# EAGLE design DUAL TRANSFORMER - OUTPUTboard (EAGLE 9.6.2)

## Sheet 1 of 2
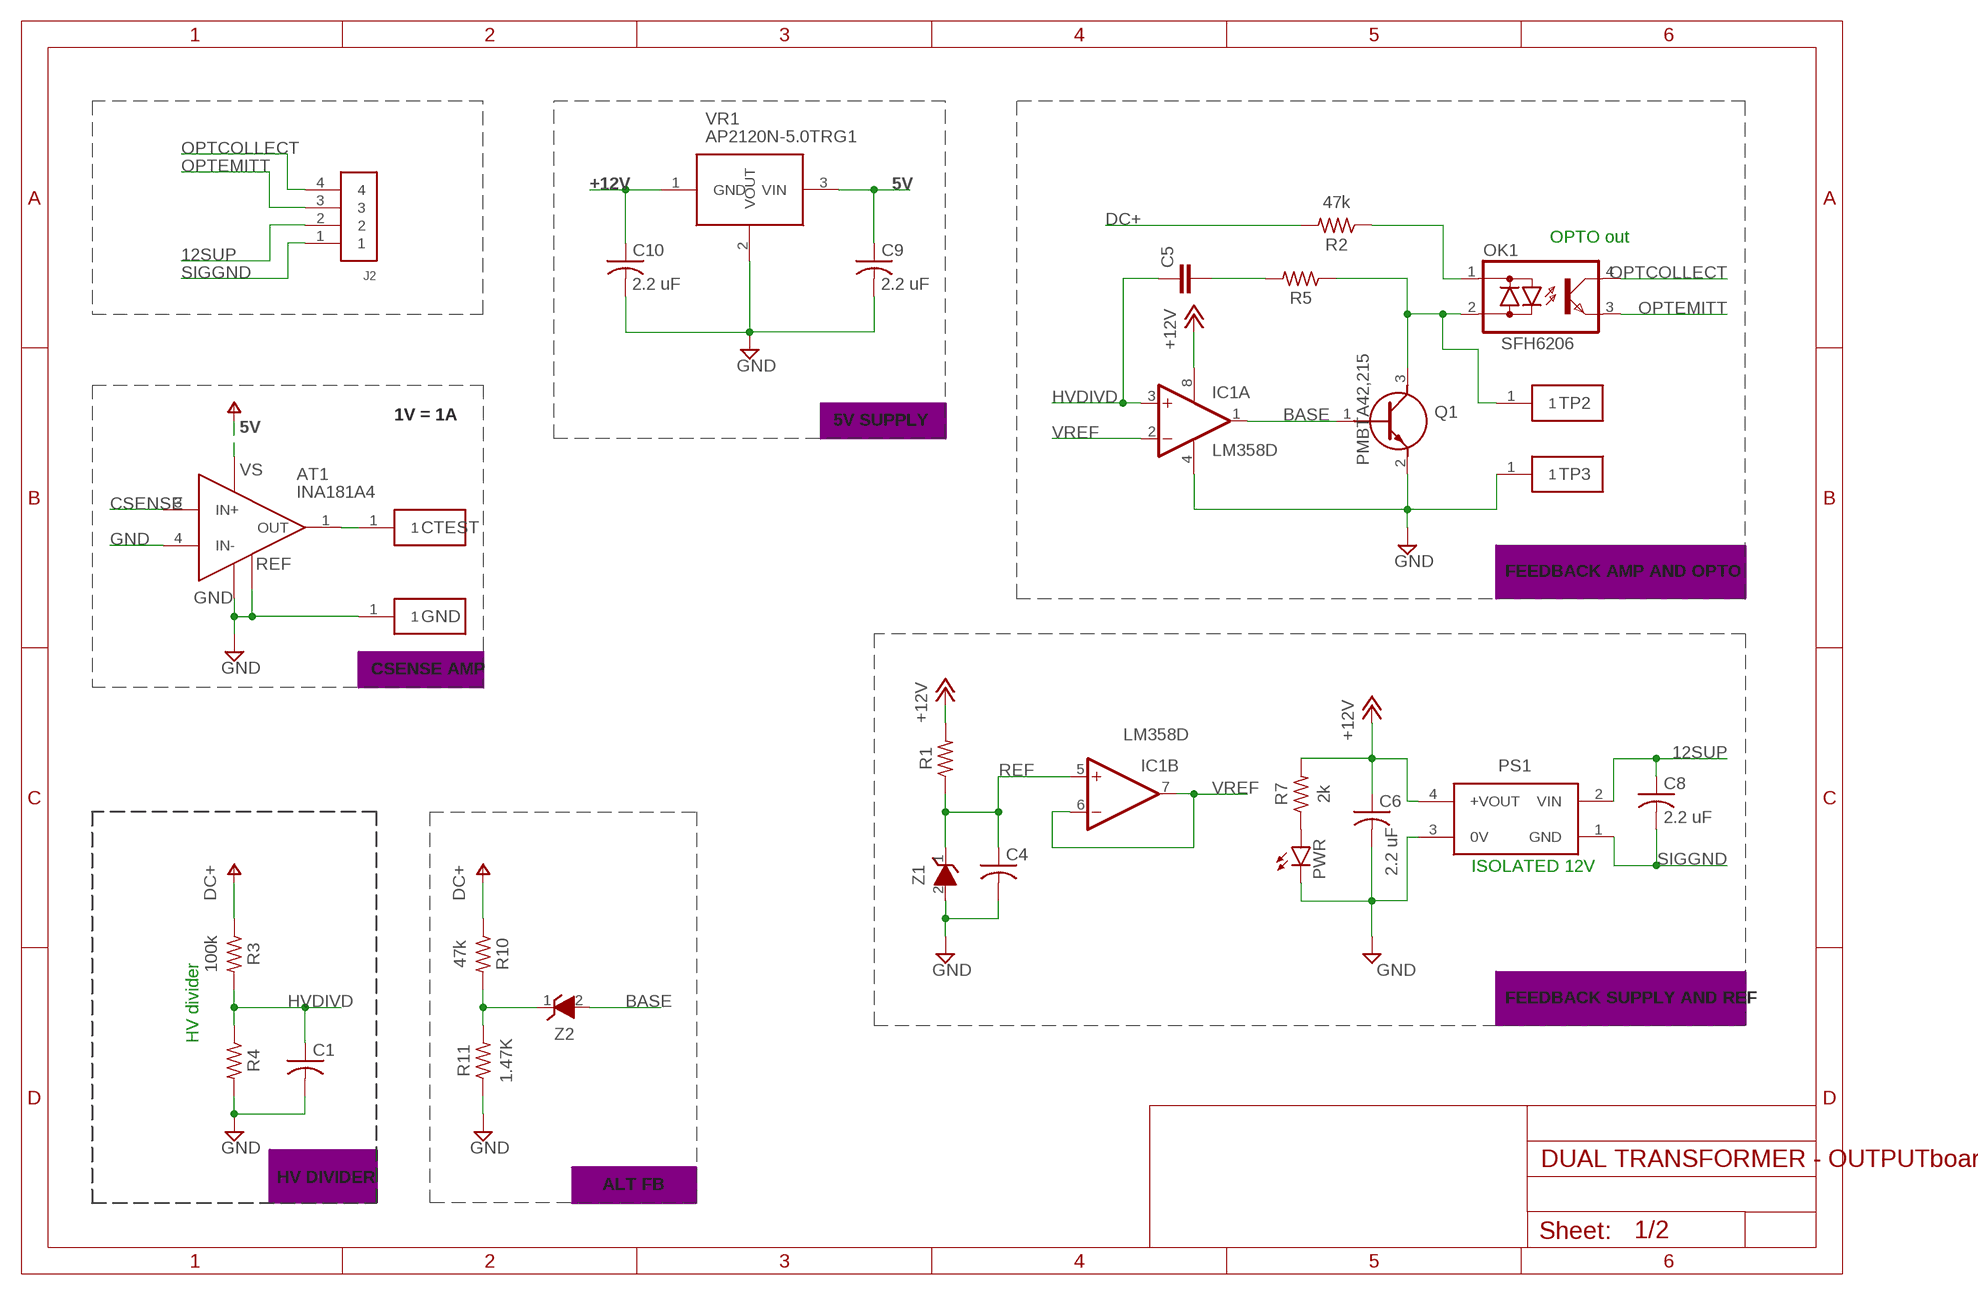
[diagram p0: schematic, sheet 1]

### Parts
AT1  INA181A4  INA181A3IDBVR  [SOT95P280X145-6N]
C1  C-USC0805  [C0805]
C4  C-USC0805  [C0805]
C5  C-EUC0805  [C0805]
C6  2.2 uF  C-USC0805  [C0805]
C8  2.2 uF  C-USC0805  [C0805]
C9  2.2 uF  C-USC0805  [C0805]
C10  2.2 uF  C-USC0805  [C0805]
CTEST  RCT-0C  [RCT-0C]
GND  RCT-0C  [RCT-0C]
IC1  LM358D  [SO08]
J2  61300411121  [61300411121]
OK1  SFH6206  [DIL4-SMD]
PS1  PDSE1-S12-S3-SPDSE1S12S12S  [PDSE1S12S3S]
PWR  LEDSML0805  [SML0805]
Q1  PMBTA42,215  [SOT95P230X110-3N]
R1  R-US_CHIP-0805(2012-METRIC)  [RESC2012X65]
R2  47k  R-US_MELF0207R  [MINI_MELF-0207R]
R3  100k  R-US_MELF0207R  [MINI_MELF-0207R]
R4  R-US_CHIP-0805(2012-METRIC)  [RESC2012X65]
R5  R-US_CHIP-0805(2012-METRIC)  [RESC2012X65]
R7  2k  R-US_CHIP-0805(2012-METRIC)  [RESC2012X65]
R10  47k  R-US_MELF0207R  [MINI_MELF-0207R]
R11  1.47K  R-US_CHIP-0805(2012-METRIC)  [RESC2012X65]
TP2  RCT-0C  [RCT-0C]
TP3  RCT-0C  [RCT-0C]
VR1  AP2120N-5.0TRG1  [SOT95P240X120-3N]
Z1  BZT52-C5V1_R1_00001  [SOD3816X135N]
Z2  BZT52-C5V1_R1_00001  [SOD3816X135N]

### Nets
5V: AT1.6(VS) C9.1 VR1.3(VIN) ; supply symbol labelled V+
12SUP: C8.1 J2.2 PS1.2(VIN)
+12V: C6.1 C10.1 IC1.8(P:V+) PS1.4(+VOUT) R1.2 R7.2 VR1.1(GND)
BASE: IC1.1(A:OUT) Q1.1(B) Z2.2(A)
CSENSE: AT1.3(IN+) ; also sheet 2
DC+: R2.2 R3.1 R10.1 ; supply symbol labelled V+ ; also sheet 2
GND: AT1.2(GND) AT1.4(IN-) AT1.5(REF) C1.2 C4.2 C6.2 C9.2 C10.2 GND.1 IC1.4(P:V-) PS1.3(0V) PWR.C Q1.2(E) R4.2 R11.1 TP3.1 VR1.2(VOUT) Z1.2(A) ; also sheet 2
HVDIVD: C1.1 C5.1 IC1.3(A:+IN) R3.2 R4.1
N$1: PWR.A R7.1
N$2: R10.2 R11.2 Z2.1(K)
N$4: OK1.1(AC1) R2.1
N$7: C5.2 R5.2
N$10: AT1.1(OUT) CTEST.1
OPTCOLLECT: J2.4 OK1.4(C)
OPTEMITT: J2.3 OK1.3(E)
OPTOANODE: OK1.2(AC2) Q1.3(C) R5.1 TP2.1
REF: C4.1 IC1.5(B:+IN) R1.1 Z1.1(K)
SIGGND: C8.2 J2.1 PS1.1(GND)
VREF: IC1.2(A:-IN) IC1.6(B:-IN) IC1.7(B:OUT)

### Notes on the sheet
- OPTO out
- 1V = 1A
- 5V SUPPLY
- FEEDBACK AMP AND OPTO
- CSENSE AMP
- ISOLATED 12V
- FEEDBACK SUPPLY AND REF
- HV divider
- HV DIVIDER
- ALT FB

## Sheet 2 of 2
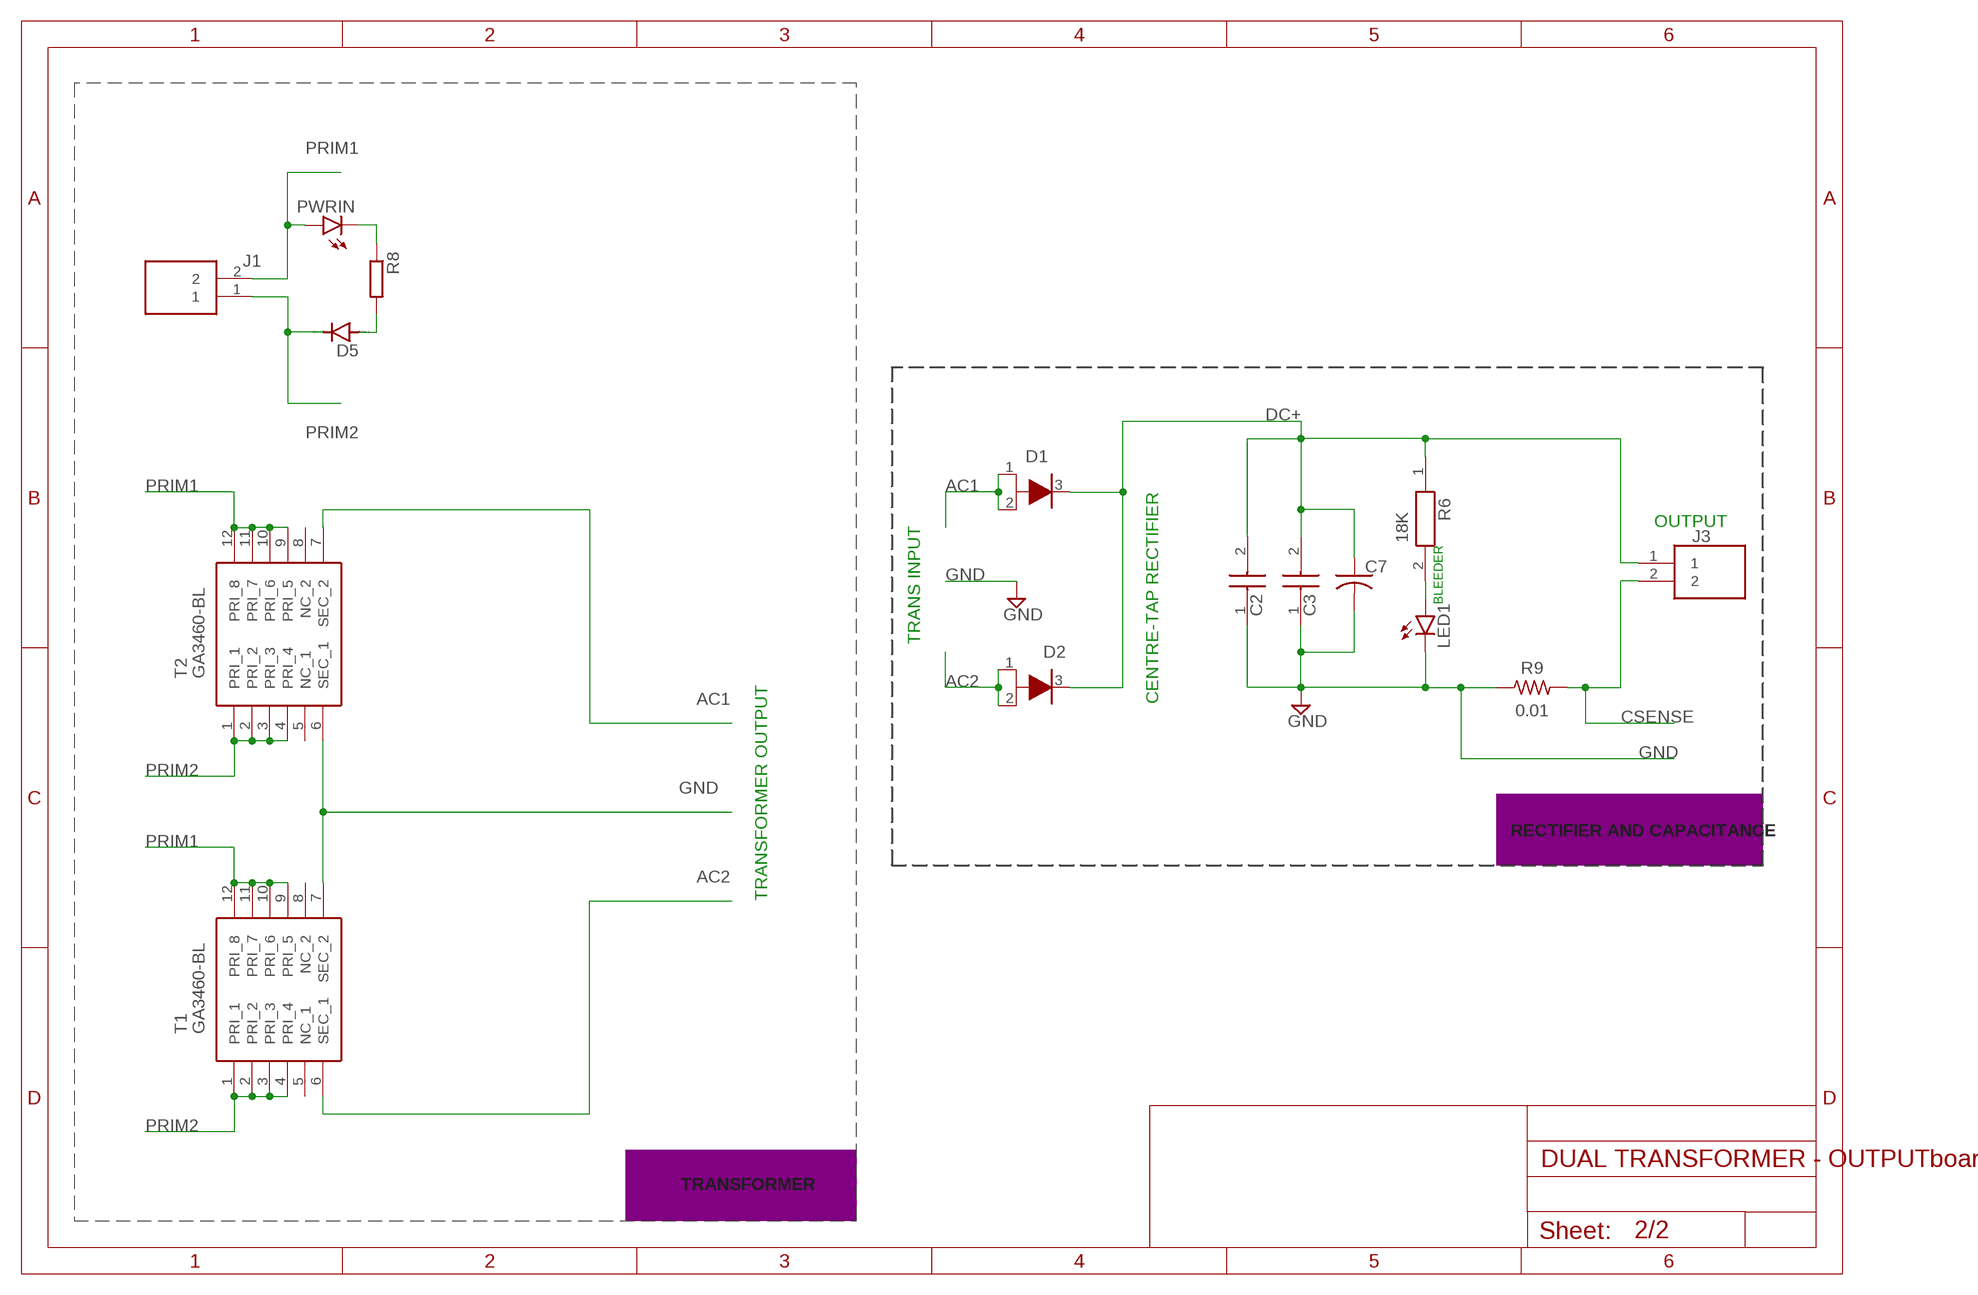
[diagram p1: schematic, sheet 2]

### Parts
C2  ELH227M400AS2AV  [CAPPRD1000W140D3000H3200]
C3  ELH227M400AS2AV  [CAPPRD1000W140D3000H3200]
C7  C-USC1210K  [C1210K]
D1  VS-16EDH02HM3_I  [V40DL45BPM3I]
D2  VS-16EDH02HM3_I  [V40DL45BPM3I]
D5  DIODE-DO-214AC  [DO-214AC]
J1  2305908-2  [23059082]
J3  2305908-2  [23059082]
LED1  LED5MM  [LED5MM]
PWRIN  LEDSML0805  [SML0805]
R6  18K  MOS2CT52R183J  [RESAD3100W80L1500D400]
R8  R-EU_R0805  [R0805]
R9  0.01  R-US_CHIP-2512(6332-METRIC)  [RESC6332X71]
T1  GA3460-BL  [GA3460BL]
T2  GA3460-BL  [GA3460BL]

### Nets
AC1: D1.1(A_1) D1.2(A) T2.7(SEC_2)
AC2: D2.1(A_1) D2.2(A) T1.6(SEC_1)
CSENSE: J3.2 R9.2 ; also sheet 1
DC+: C2.2(-) C3.2(-) C7.1 D1.3(K) D2.3(K) J3.1 R6.1 ; also sheet 1
GND: C2.1(+) C3.1(+) C7.2 LED1.K(C) R9.1 T1.7(SEC_2) T2.6(SEC_1) ; also sheet 1
N$3: D5.A R8.2
N$5: LED1.A R6.2
N$6: PWRIN.C R8.1
PRIM1: J1.2 PWRIN.A T1.9(PRI_5) T1.10(PRI_6) T1.11(PRI_7) T1.12(PRI_8) T2.9(PRI_5) T2.10(PRI_6) T2.11(PRI_7) T2.12(PRI_8)
PRIM2: D5.C J1.1 T1.1(PRI_1) T1.2(PRI_2) T1.3(PRI_3) T1.4(PRI_4) T2.1(PRI_1) T2.2(PRI_2) T2.3(PRI_3) T2.4(PRI_4)
Unconnected: T1.5(NC_1) T1.8(NC_2) T2.5(NC_1) T2.8(NC_2)

### Notes on the sheet
- CENTRE-TAP RECTIFIER
- TRANS INPUT | OUTPUT
- BLEEDER
- RECTIFIER AND CAPACITANCE
- TRANSFORMER OUTPUT
- TRANSFORMER

## Library data of the parts
AT1 = SamacSys_Parts:INA181A3IDBVR: Automotive, 26V bi-directional current sense amplifier for cost-sensitive systems Source: Datasheet <http://www.ti.com/lit/gpn/INA181>; DESCRIPTION: Automotive, 26V bi-directional current sense amplifier for cost-sensitive systems; HEIGHT: 1.45mm; MANUFACTURER_NAME: Texas Instruments; MANUFACTURER_PART_NUMBER: INA181A3IDBVR; MOUSER_PART_NUMBER: 595-INA181A3IDBVR; MOUSER_PRICE-STOCK: https://www.mouser.co.uk/ProductDetail/Texas-Instruments/INA181A3IDBVR?qs=5aG0NVq1C4xG8aOdRB7o5A%3D%3D
C1 C4 C6-C10 = rcl:C-US: CAPACITOR, American symbol; SPICEPREFIX: C
C2 C3 = SamacSys_Parts:ELH227M400AS2AV: Aluminum Electrolytic Capacitors - Snap In 400V 220uF 20% 85C Radial Source: Datasheet <https://www.kemet.com/specsheet/ELH227M400AS2AV>; DESCRIPTION: Aluminum Electrolytic Capacitors - Snap In 400V 220uF 20% 85C Radial; HEIGHT: 32mm; MANUFACTURER_NAME: Kemet; MANUFACTURER_PART_NUMBER: ELH227M400AS2AV; MOUSER_PART_NUMBER: 80-ELH227M400AS2AV; MOUSER_PRICE-STOCK: https://www.mouser.co.uk/ProductDetail/KEMET/ELH227M400AS2AV?qs=gt1LBUVyoHkpN%252BwKS%2FOtFw%3D%3D
C5 = rcl:C-EU: CAPACITOR, European symbol; SPICEPREFIX: C
CTEST GND TP2 TP3 = SamacSys_Parts:RCT-0C: TE CONNECTIVITY / CGS - RCT-0C - TEST POINT, 0805 CASE SIZE Source: Datasheet; DESCRIPTION: TE CONNECTIVITY / CGS - RCT-0C - TEST POINT, 0805 CASE SIZE; HEIGHT: mm; MANUFACTURER_NAME: TE Connectivity; MANUFACTURER_PART_NUMBER: RCT-0C; MOUSER_PART_NUMBER: 279-RCT-0C; MOUSER_PRICE-STOCK: https://www.mouser.co.uk/ProductDetail/TE-Connectivity-Holsworthy/RCT-0C?qs=ip69W3eHERWzZOsRKmFYAw%3D%3D
D1 D2 = SamacSys_Parts:VS-16EDH02HM3_I: VISHAY -VS-8ETH03S-M3 - RECTIFIER, 8A, 300V, TO-263AC Source: Datasheet <https://www.mouser.com/datasheet/2/427/VISH_S_A0007982235_1-2570276.pdf>; DESCRIPTION: VS-8ETH03S-M3 - RECTIFIER, 8A, 300V, TO-263; HEIGHT: 1mm; MANUFACTURER_NAME: Vishay; MANUFACTURER_PART_NUMBER: VS-8ETH03S-M3
D5 = diode:DIODE-: DIODE
IC1 = linear:LM358: OP AMP also LM158; LM258; LM2904 Source: http://cache.national.com/ds/LM/LM158.pdf
J1 J3 = SamacSys_Parts:2305908-2: TE CONNECTIVITY / BUCHANAN - 2305908-2 - TERMINAL BLOCK, HEADER, 2POS, SMD Source: Datasheet <https://www.te.com/commerce/DocumentDelivery/DDEController?Action=srchrtrv&DocNm=1-1773930-3_BuchananWM_Brochure&DocType=Data Sheet&DocLang=English&PartCntxt=2305908-2&DocFormat=pdf>; DESCRIPTION: TE CONNECTIVITY / BUCHANAN - 2305908-2 - TERMINAL BLOCK, HEADER, 2POS, SMD; HEIGHT: 9mm; MANUFACTURER_NAME: TE Connectivity; MANUFACTURER_PART_NUMBER: 2305908-2; MOUSER_PART_NUMBER: 571-2305908-2; MOUSER_PRICE-STOCK: https://www.mouser.co.uk/ProductDetail/TE-Connectivity-Buchanan/2305908-2?qs=BZBei1rCqCB0kX75zk6ERQ%3D%3D
J2 = Headers:61300411121: CONN HEADER VERT 4POS 2.54MM Manufacturer's datasheet <https://katalog.we-online.de/em/datasheet/6130xx11121.pdf>; CREATED_BY: PCBLayout.com; DIGI_KEY_PART_NUMBER: 732-5317-ND; MANUFACTURER: Wurth Electronics Inc.; MPN: 61300411121
LED1 PWR PWRIN = led:LED: LED OSRAM: - CHIPLED LG R971, LG N971, LY N971, LG Q971, LY Q971, LO R971, LY R971 LH N974, LH R974 LS Q976, LO Q976, LY Q976 LO Q996 - Hyper CHIPLED LW Q18S LB Q993, LB Q99A, LB R99A - SideLED LS A670, LO A670, LY A670, LG A670, LP A670 LB A673, LV A673, LT A673, LW A673 LH A674 LY A675 LS A676, LA A676, LO A676, LY A676, LW A676 LS A679, LY A679, LG A679 - Hyper Micro SIDELED® LS Y876, LA Y876, LO Y876, LY Y876 LT Y87S - SmartLED LW L88C, LW L88S LB L89C, LB L89S, LG L890 LS L89K, LO L89K, LY L89K LS L896, LA L896, LO L896, LY L896 - TOPLED LS T670, LO T670, LY T670, LG T670, LP T670 LSG T670, LSP T670, LSY T670, LOP T670, LYG T670 LG T671, LOG T671, LSG T671 LB T673, LV T673, LT T673, LW T673 LH T674 LS T676, LA T676, LO T676, LY T676, LB T676, LH T676, LSB T676, LW T676 LB T67C, LV T67C, LT T67C, LS T67K, LO T67K, LY T67K, LW E67C LS E67B, LA E67B, LO E67B, LY E67B, LB E67C, LV E67C, LT E67C LW T67C LS T679, LY T679, LG T679 LS T770, LO T770, LY T770, LG T770, LP T770 LB T773, LV T773, LT T773, LW T773 LH T774 LS E675, LA E675, LY E675, LS T675 LS T776, LA T776, LO T776, LY T776, LB T776 LHGB T686 LT T68C, LB T68C - Hyper Mini TOPLED® LB M676 - Mini TOPLED Santana® LG M470 LS M47K, LO M47K, LY M47K Source: http://www.osram.convergy.de LUXEON: - LUMILED® LXK2-PW12-R00, LXK2-PW12-S00, LXK2-PW14-U00, LXK2-PW14-V00 LXK2-PM12-R00, LXK2-PM12-S00, LXK2-PM14-U00 LXK2-PE12-Q00, LXK2-PE12-R00, LXK2-PE12-S00, LXK2-PE14-T00, LXK2-PE14-U00 LXK2-PB12-K00, LXK2-PB12-L00, LXK2-PB12-M00, LXK2-PB14-N00, LXK2-PB14-P00, LXK2-PB14-Q00 LXK2-PR12-L00, LXK2-PR12-M00, LXK2-PR14-Q00, LXK2-PR14-R00 LXK2-PD12-Q00, LXK2-PD12-R00, LXK2-PD12-S00 LXK2-PH12-R00, LXK2-PH12-S00 LXK2-PL12-P00, LXK2-PL12-Q00, LXK2-PL12-R00 Source: www.luxeon.com KINGBRIGHT: KA-3528ASYC Source: www.kingbright.com
OK1 = optocoupler:SFH620: Optocoupler, Phototransistor Output, AC Input Source: http://www.vishay.com/docs/83675/sfh620.pdf; MF: VISHAY/TELEFUNKEN; MPN: SFH6206-3; OC_FARNELL: 1469585; OC_NEWARK: 58K2214
PS1 = SamacSys_Parts:PDSE1-S12-S3-S: Isolated DC/DC Converters 12 Vdc, 0.303 A, 1 W, 10.8 13.2 Vdc Input Range Source: Datasheet <https://www.arrow.com/en/products/pdse1-s12-s3-s/cui-inc?region=nac>; DESCRIPTION: Isolated DC/DC Converters 12 Vdc, 0.303 A, 1 W, 10.8 13.2 Vdc Input Range; HEIGHT: 10.41mm; MANUFACTURER_NAME: CUI Inc.; MANUFACTURER_PART_NUMBER: PDSE1-S12-S12-S; MOUSER_PART_NUMBER: 490-PDSE1-S12-S12-S
Q1 = SamacSys_Parts:PMBTA42,215: PMBTA42 - 300 V, 100 mA NPN high-voltage transistor Source: Datasheet <http://assets.nexperia.com/documents/data-sheet/PMBTA42.pdf>; DESCRIPTION: PMBTA42 - 300 V, 100 mA NPN high-voltage transistor; HEIGHT: 1.1mm; MANUFACTURER_NAME: Nexperia; MANUFACTURER_PART_NUMBER: PMBTA42,215; MOUSER_PART_NUMBER: 771-PMBTA42-T/R; MOUSER_PRICE-STOCK: https://www.mouser.co.uk/ProductDetail/Nexperia/PMBTA42215?qs=LOCUfHb8d9skgG8A751Qfw%3D%3D
R1 R4 R5 R7 R9 R11 = Resistor:R-US: Resistor Fixed - ANSI; CATEGORY: Resistor; SUB-CATEGORY: Fixed
R2 R3 R10 = rcl:R-US_: RESISTOR, American symbol; SPICEPREFIX: R
R6 = SamacSys_Parts:MOS2CT52R183J: Metal Oxide Resistors 2W 18K 5% Source: Datasheet; DESCRIPTION: Metal Oxide Resistors 2W 18K 5%; HEIGHT: mm; MANUFACTURER_NAME: KOA Speer; MANUFACTURER_PART_NUMBER: MOS2CT52R183J
R8 = rcl:R-EU_: RESISTOR, European symbol; SPICEPREFIX: R
T1 T2 = SamacSys_Parts:GA3460-BL: Audio Transformers / Signal Transformers GA3460 for LT3751 500V 50A Source: Datasheet <https://componentsearchengine.com/Datasheets/1/GA3460-BL.pdf>; DESCRIPTION: Audio Transformers / Signal Transformers GA3460 for LT3751 500V 50A; HEIGHT: 14mm; MANUFACTURER_NAME: COILCRAFT; MANUFACTURER_PART_NUMBER: GA3460-BL; MOUSER_PART_NUMBER: 994-GA3460-BL; MOUSER_PRICE-STOCK: https://www.mouser.co.uk/ProductDetail/Coilcraft/GA3460-BL?qs=ZYnrCdKdyeeqpRItZMyzHA%3D%3D
VR1 = SamacSys_Parts:AP2120N-5.0TRG1: IC REG LINEAR 5V 150MA SOT23 Source: Datasheet; DESCRIPTION: IC REG LINEAR 5V 150MA SOT23; HEIGHT: 1.2mm; MANUFACTURER_NAME: Diodes Inc.; MANUFACTURER_PART_NUMBER: AP2120N-5.0TRG1; MOUSER_PART_NUMBER: 621-AP2120N-5.0TRG1; MOUSER_PRICE-STOCK: https://www.mouser.co.uk/ProductDetail/Diodes-Incorporated/AP2120N-50TRG1?qs=M%2FOdCRO8QQ3JQu49DdtyIA%3D%3D
Z1 Z2 = SamacSys_Parts:BZT52-C5V1_R1_00001: Zener Diodes /W9/TR/7"/HF/3K/SOD-123/ZEN/SOD/ZSM-04/ZSM04-QI01/PJ/// Source: Datasheet <https://www.panjit.com.tw/upload/datasheet/BZT52-C2V4_SERIES.pdf>; DESCRIPTION: Zener Diodes /W9/TR/7"/HF/3K/SOD-123/ZEN/SOD/ZSM-04/ZSM04-QI01/PJ///; HEIGHT: 1.35mm; MANUFACTURER_NAME: PANJIT; MANUFACTURER_PART_NUMBER: BZT52-C5V1; MOUSER_PART_NUMBER: 241-BZT52C5V1; MOUSER_PRICE-STOCK: https://www.mouser.co.uk/ProductDetail/Panjit/BZT52-C5V1_R1_00001?qs=sPbYRqrBIVmNRH6w8kVt6A%3D%3D

## Board
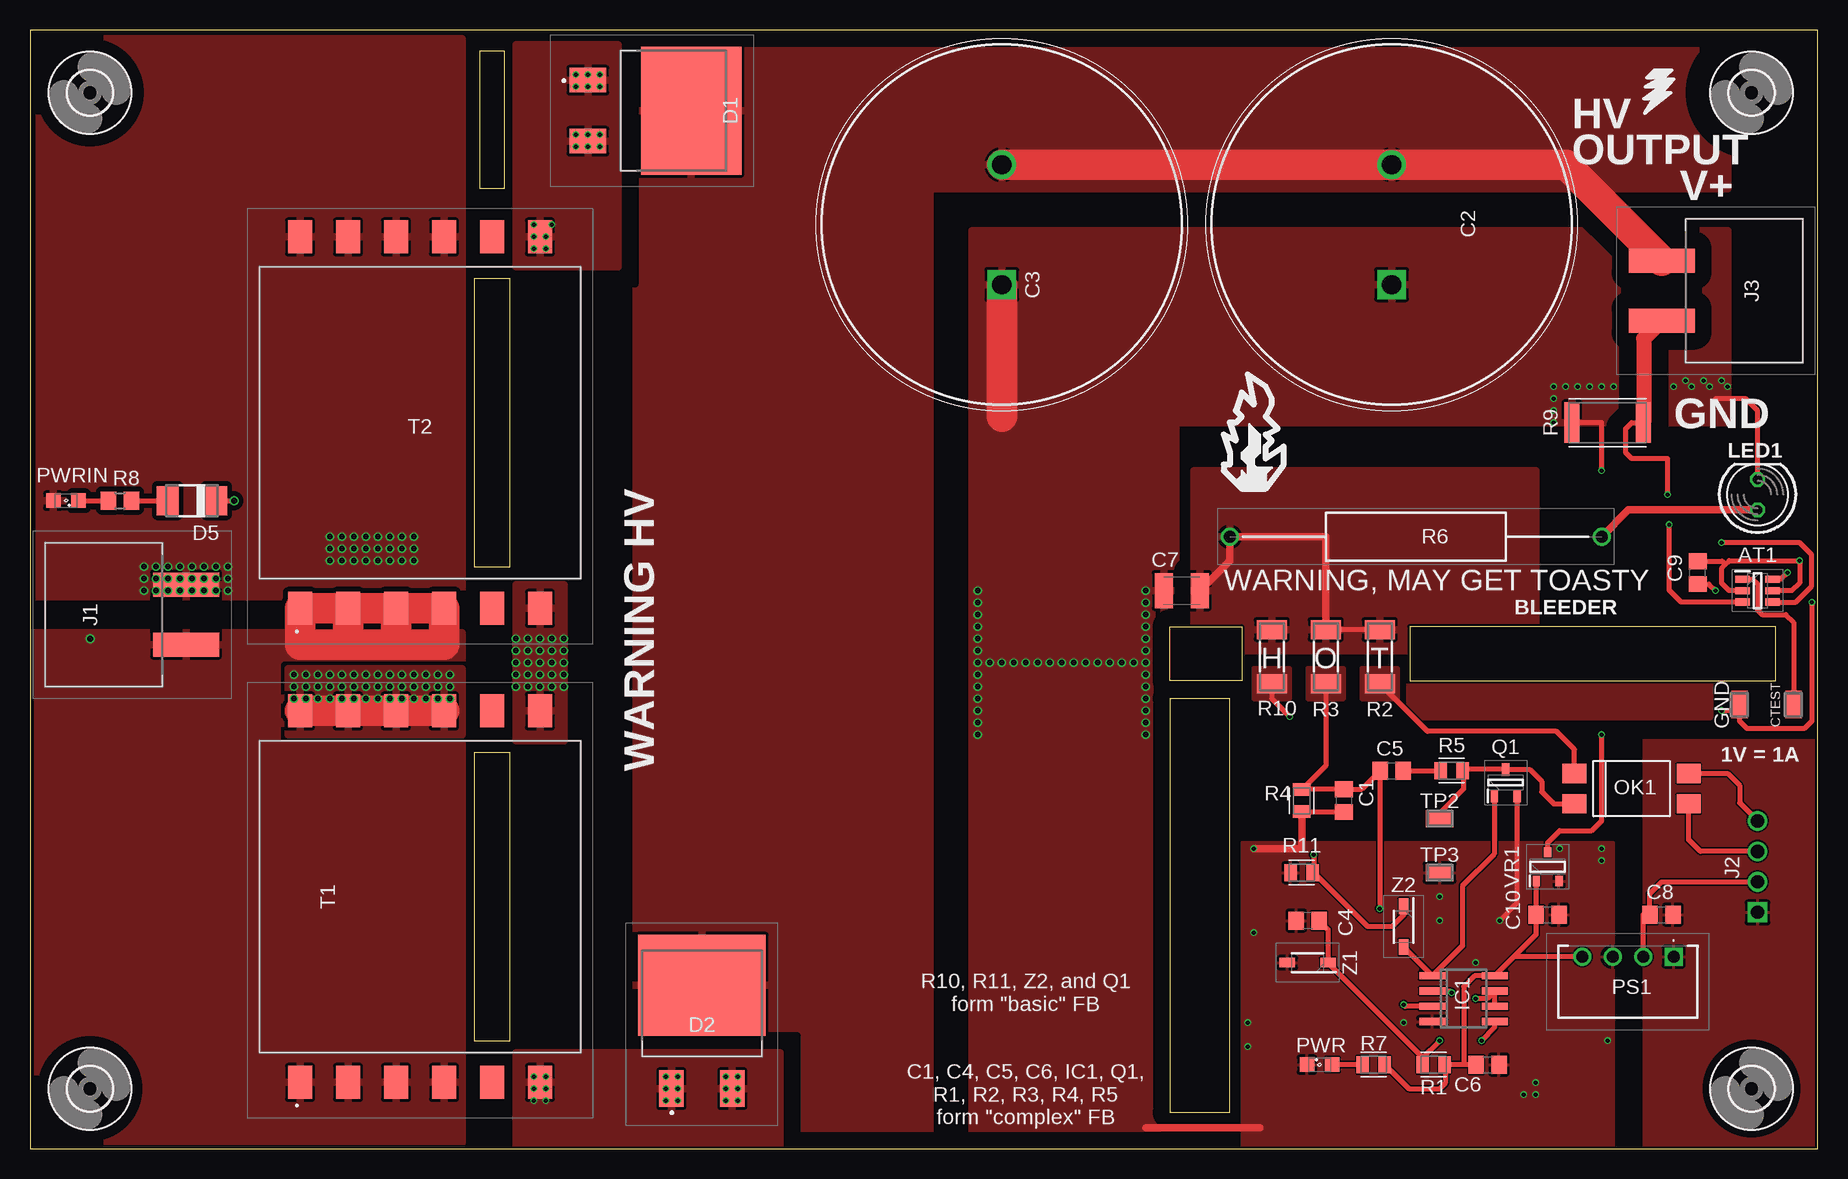
[diagram p2: board, top side]
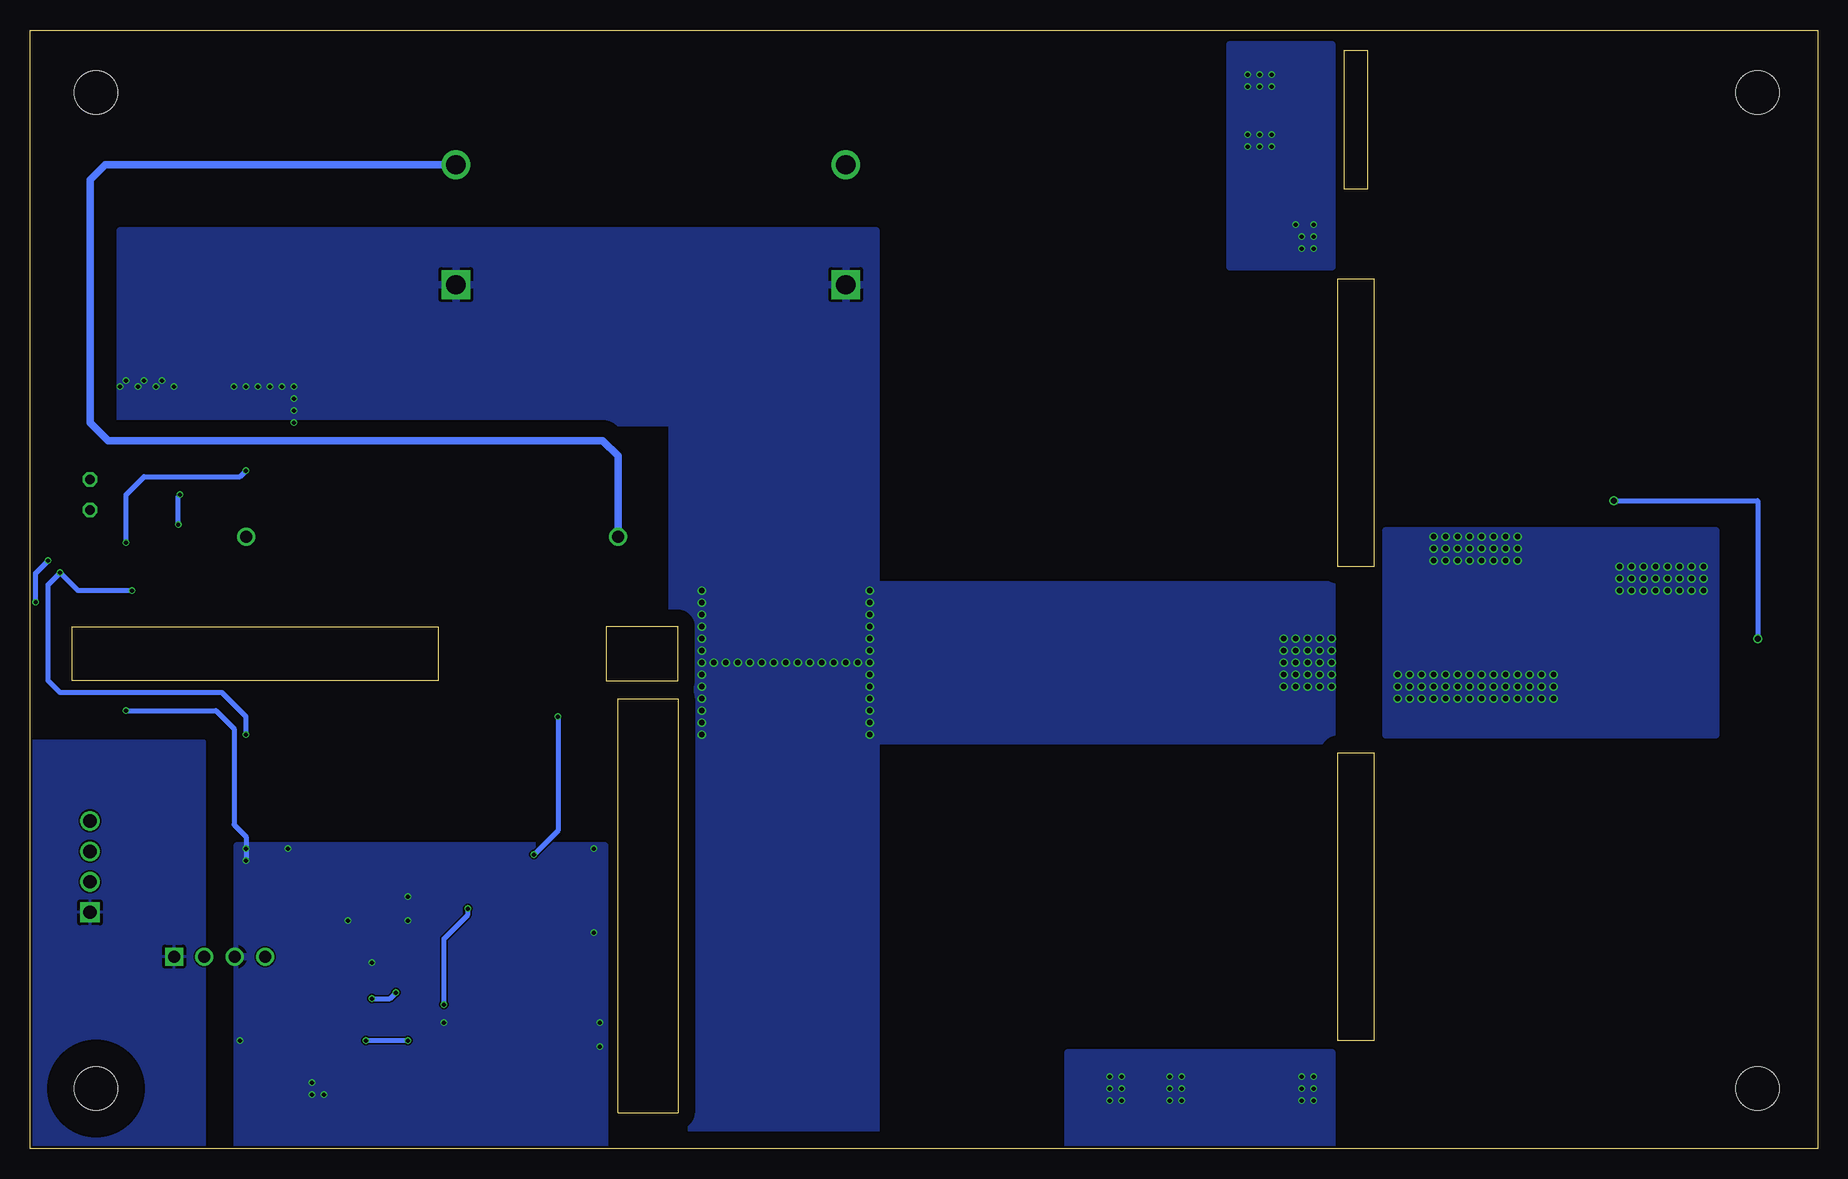
[diagram p3: board, bottom side, seen from below]

Size 149 x 93.22 mm. Coordinates in mm from the lower left corner, seen from the top.
Outline: 0,0 149,0 149,93.22 0,93.22 0,0
Outline: 145.5,43.5 115,43.5 115,39 145.5,39 145.5,43.5
Outline: 95,39 95,43.5 101,43.5 101,39 95,39
Outline: 100,3 100,37.5 95,37.5 95,3 100,3
Outline: 37,9 40,9 40,33 37,33 37,9
Outline: 37,48.5 40,48.5 40,72.5 37,72.5 37,48.5
Outline: 39.5,80 37.5,80 37.5,91.5 39.5,91.5 39.5,80
Copper layers (1*16): Top 0.035559375mm / dielectric 1.6mm / Bottom 0.035559375mm
Design rules "jlcpcb2layer *": minimum track width 5mil, minimum drill 12mil, track to track 5mil, track to pad 5mil, pad to pad 5mil, via to via 5mil, smd to smd 5mil, copper to edge 8mil, drill to drill 6mil, minimum pad ring 5mil, minimum via ring 3mil, stop-mask expansion 2.5mil, vias tented up to drill 20mil, thermal gap 10mil

### Footprints (pad centres in the part's own frame; a part is rotated, then mirrored left to right if it is on the bottom)
SOT95P280X145-6N = smd 1.2 x 0.6: 1 -1.25,0.95; 2 -1.25,0; 3 -1.25,-0.95; 4 1.25,-0.95; 5 1.25,0; 6 1.25,0.95
C0805 = smd 1.3 x 1.5: 1 -0.95,0; 2 0.95,0
CAPPRD1000W140D3000H3200 = drill 1.6 pad 2.4 square: 1 0,0 | drill 1.6 pad 2.4: 2 10,0
C1210K = smd 1.5 x 2.9: 1 -1.5,0; 2 1.5,0
RCT-0C = smd 2.3 x 1.4: 1 0,0
V40DL45BPM3I = smd 2.03 x 3.05: 1 -2.54,-11.5; 2 2.54,-11.5 | smd 10.66 x 8.38: 3 0,-2.885
DO-214AC = smd 1.8 x 2.4: A 2.025,0; C -2.025,0
SO08 = smd 0.6 x 2.2: 1 -1.905,-2.6; 2 -0.635,-2.6; 3 0.635,-2.6; 4 1.905,-2.6; 5 1.905,2.6; 6 0.635,2.6; 7 -0.635,2.6; 8 -1.905,2.6
23059082 = smd 2 x 5.5: 1 -2.5,-4.5; 2 2.5,-4.5
61300411121 = drill 1.1 square: 1 -3.81,0 | drill 1.1: 2 -1.27,0; 3 1.27,0; 4 3.81,0
LED5MM = drill 0.813 octagon: A -1.27,0; K 1.27,0
DIL4-SMD = smd 1.6 x 2: 1 -1.27,-4.77; 2 1.27,-4.77; 3 1.27,4.77; 4 -1.27,4.77
PDSE1S12S3S = drill 1 pad 1.5 square: 1 0,0 | drill 1 pad 1.5: 2 2.54,0; 3 5.08,0; 4 7.62,0
SML0805 = smd 1.2 x 1.2: A 1.05,0; C -1.05,0
SOT95P230X110-3N = smd 1.05 x 0.6: 1 -1.1,0.95; 2 -1.1,-0.95; 3 1.1,0
RESC2012X65 = smd 1.031 x 1.42: 1 -0.919,0; 2 0.919,0
MINI_MELF-0207R = smd 1.6 x 2.5: 1 -2.25,0; 2 2.25,0
RESAD3100W80L1500D400 = drill 1 pad 1.5: 1 0,0; 2 31,0
R0805 = smd 1.3 x 1.5: 1 -0.95,0; 2 0.95,0
RESC6332X71 = smd 1.231 x 3.37: 1 -2.97,0; 2 2.97,0
GA3460BL = smd 2 x 2.75: 1 -10,-15.475; 2 -6,-15.475; 3 -2,-15.475; 4 2,-15.475; 5 6,-15.475; 6 10,-15.475; 7 10,15.475; 8 6,15.475; 9 2,15.475; 10 -2,15.475; 11 -6,15.475; 12 -10,15.475
3,6 = hole 3.6: 0,0
SOT95P240X120-3N = smd 0.85 x 0.6: 1 -1.2,0.95; 2 -1.2,-0.95; 3 1.2,0
SOD3816X135N = smd 1.3 x 0.8: 1 -1.7,0; 2 1.7,0

### Placement (x,y rotation side)
AT1  144,46.5 0 top
C1  109.5,29 270 top
C2  113.5,72 90 top
C3  81,72 90 top
C4  106.5,19 180 top
C5  113.5,31.5 0 top
C6  121.5,7 0 top
C7  96,46.5 180 top
C8  136,19.5 0 top
C9  139,48 90 top
C10  126.5,19.5 0 top
CTEST  147,37 90 top
D1  58,86.5 270 top
D2  56,16.5 0 top
D5  13.5,54 180 top
GND  142.5,37 90 top
IC1  119.5,12.5 270 top
J1  8.5,44.5 90 top
J2  144,23.5 90 top
J3  140.5,71.5 270 top
LED1  144,54.5 90 top
OK1  133.5,30 270 top
PS1  137,16 180 top
PWR  107.5,7 0 top
PWRIN  3,54 180 top
Q1  123,30.5 90 top
R1  117,7 0 top
R2  112.5,41 90 top
R3  108,41 270 top
R4  106,29 270 top
R5  118.5,31.5 180 top
R6  100,51 0 top
R7  112,7 0 top
R8  7.5,54 0 top
R9  131.5,60.5 0 top
R10  103.5,41 270 top
R11  106,23 0 top
T1  32.5,21 0 top
T2  32.5,60.5 0 top
TP2  117.5,27.5 0 top
TP3  117.5,23 0 top
U$1  [3,6]  5,5 0 top
U$2  [3,6]  5,88 0 top
U$3  [3,6]  143.5,88 0 top
U$4  [3,6]  143.5,5 0 top
VR1  126.5,23.5 90 top
Z1  106.5,15.5 180 top
Z2  114.5,18.5 270 top

### Tracks (layer width: path | path; a pad name or v marks a point on that pad's centre or on a via)
5V  (via drill 0.35)
  Top 0.406: VR1.3 126.5,25.5 127.5,26.5 130.18,26.5 131,27.32 v131,34.5 | v146.5,48 145.95,47.45 AT1.6 | C9.1 139.95,47.05 v140.5,46.5
  Bottom 0.406: v131,34.5 131,36 133,38 146.5,38 147.5,39 147.5,47 v146.5,48 145,46.5 v140.5,46.5
12SUP
  Top 0.406: PS1.2 134.46,19.5 C8.1 135,19.55 135,21.23 136,22.23 J2.2
+12V
  Top 0.406: PS1.4 123.69,16 IC1.8 | C6.1 R1.2 | IC1.8 120.41,14.4 119.5,13.5 119.5,7.08 119.42,7 R1.2 | R7.2 114.92,5 117.5,5 118,5.5 118,6.92 R1.2 | IC1.8 125.55,17.86 C10.1 VR1.1
AC1  (via drill 0.35)
  other vias: 42,77 43.5,77 43,76 43,75 42,75 42,76 45.5,83.5 45.5,84.5 46.5,84.5 47.5,84.5 47.5,83.5 46.5,83.5 45.5,88.5 45.5,89.5 46.5,89.5 47.5,89.5 47.5,88.5 46.5,88.5
  pour Top: 49,92 40.5,92 40.5,73.5 49,73.5
  pour Bottom: 49,92 40.5,92 40.5,73.5 49,73.5
AC2  (via drill 0.35)
  other vias: 43,5 43,6 42,6 43,4 42,4 42,5 54,5 54,6 53,6 54,4 53,4 53,5 59,5 59,6 58,6 59,4 58,4 58,5
  pour Top: 62.5,8 40.5,8 40.5,-1 41,-1.5 62.5,-1.5
  pour Bottom: 62.5,8 40.5,8 40.5,-1.5 62.5,-1.5
BASE
  Top 0.406: Q1.1 122.05,24.55 119.4,21.9 119.4,16.91 IC1.1 Z2.2
CSENSE  (via drill 0.35)
  Top 0.406: AT1.3 137.63,45.55 136.63,46.55 v136.63,52 | v136.5,54.5 136.5,57.5 133.5,57.5 133,58 133,60 133.5,60.5 R9.2
  Top 1.27: J3.2 134.5,67.5 134.5,60.53 R9.2
  Bottom 0.406: v136.63,52 136.63,54.37 v136.5,54.5
DC+
  Top 0.406: R2.2 R3.1
  Top 0.61: C7.1 100,49 R6.1 108,51 R3.1
  Top 2.54: C3.2 C2.2 128,82 J3.1
  Bottom 0.61: R6.1 100,57.73 101.27,59 142.5,59 144,60.5 144,80.73 142.73,82 C2.2
  pour Top (isolate 1.422): 141.5,92.62 79.5,92.62 79.5,80 141.5,80
  pour Top: 97,41.5 125.5,41.5 125.5,56.5 97,56.5
  pour Top (isolate 1.422, rank 5): 85,94.5 50.5,94.5 50.5,-8.5 75,-8.5 75,80 85,80
GND  (via drill 0.35, 0.45)
  Top 0.406: C1.2 106.03,28.05 R4.2 | Q1.2 123.95,20.45 v122.5,19 | LED1.K 144,61.5 143,62.5 140.5,62.5 | AT1.2 141.63,46.5 141,47.13 141,48.37 141.32,48.68 | 141.32,48.68 141.63,49 v147.5,49 147.5,47.13 146.87,46.5 AT1.5 | v148.53,45.53 148.53,35.63 147.9,35 143.13,35 142.5,35.63 GND.1 142,36.5 v141,36.5 | AT1.4 147.18,45.55 148.5,46.87 148.5,49.5 147.5,50.5 v141,50.5 | v131,56.5 131,60.5 R9.1 | C9.2 141.05,48.95 141.32,48.68
  Top 0.61: R4.2 106,25 v102,25 | 93,1.75 102.5,1.75
  Top 2.54: 81,61 C3.1
  Bottom 0.406: v141,50.5 141,54.5 139.5,56 131.5,56 v131,56.5 | v148.53,45.53 148.53,47.97 v147.5,49 | v141,36.5 133.5,36.5 132,35 132,27 131,26 v131,24
  other vias: 127.5,25 131,25 101.5,10.5 101.5,8.5 131.5,9 125.5,4.5 124.5,4.5 125.5,5.5 117.5,21 102,18 114.5,10.5 117.5,19 120.5,15.5 137,63.5 140,63.5 138.5,63.5 141.5,63.5 138,64 139.5,64 141,64 129,63.5 128,63.5 130,63.5 127,62.5 127,61.5 131,63.5 127,63.5 127,60.5 132,63.5 40.5,40.5 41.5,40.5 42.5,40.5 43.5,40.5 44.5,40.5 40.5,39.5 41.5,39.5 42.5,39.5 43.5,39.5 44.5,39.5 44.5,41.5 43.5,41.5 42.5,41.5 41.5,41.5 40.5,41.5 44.5,42.5 44.5,38.5 43.5,42.5 42.5,42.5 41.5,42.5 40.5,42.5 40.5,38.5 41.5,38.5 42.5,38.5 43.5,38.5 79,46.5 79,34.5 93,34.5 93,46.5 79,40.5 79,35.5 79,36.5 79,37.5 79,38.5 79,39.5 79,41.5 79,42.5 79,43.5 79,44.5 79,45.5 93,45.5 93,44.5 93,43.5 93,42.5 93,41.5 93,40.5 93,39.5 93,38.5 93,37.5 93,36.5 93,35.5 92,40.5 91,40.5 80,40.5 81,40.5 82,40.5 83,40.5 84,40.5 85,40.5 86,40.5 87,40.5 90,40.5 88,40.5 89,40.5
  pour Top: 101,-2.5 132,-2.5 132,25.5 101,25.5
  pour Top (isolate 1.422): 78.5,76.5 78.5,-4 95.5,-4 95.5,60.5 141.5,60.5 141.5,76.5
  pour Bottom: 131.75,-2.5 131.75,25.25 101.12,25.25 101.12,-2.5
  pour Bottom (isolate 1.422, rank 6): 141.5,76.5 78.5,76.5 78.5,47 40.5,47 40.5,34 78.5,34 78.5,-1 94,-1 94,44.5 95.5,44.5 95.5,60.5 141.5,60.5
  pour Top: 44.5,47 40.5,47 40.5,34 44.5,34
HVDIVD  (via drill 0.35)
  Top 0.406: R3.2 108,31.92 R4.1 106.03,29.95 C1.1 111,29.95 C5.1 112.5,31.55 v112.5,20 | IC1.3 114.64,11.87 v114.5,12
  Bottom 0.406: v114.5,12 114.5,17.5 112.5,19.5 v112.5,20
  pour Top (no thermals): 109.5,40 106.5,40 106.5,37.5 109.5,37.5
N$1
  Top 0.406: R7.1 PWR.A
N$2  (via drill 0.35)
  Top 0.406: R10.2 103.5,37.5 v105,36 | v107,24.5 107,23.08 R11.2 107,23 111.5,18.5 113.5,18.5 114.5,19.5 Z2.1
  Bottom 0.406: v105,36 105,26.5 v107,24.5
  pour Top (no thermals): 105,40 102,40 102,37.5 105,37.5
N$3
  Top 0.406: R8.2 D5.A
N$4
  Top 0.406: OK1.1 128.73,33.27 127.23,34.77 116.48,34.77 R2.1
  pour Top (no thermals): 114,40 111,40 111,37.5 114,37.5
N$5
  Top 0.61: R6.2 133.23,53.23 LED1.A
N$6
  Top 0.406: PWRIN.C R8.1
N$7
  Top 0.406: C5.2 117.49,31.5 117.48,31.6 R5.2
N$10
  Top 0.406: AT1.1 143.62,47.45 144,47.06 144,44.88 144.38,44.5 146.37,44.5 147,43.87 CTEST.1
OPTCOLLECT
  Top 0.406: OK1.4 141.5,31.27 142.5,30.27 142.5,28.81 J2.4
OPTEMITT
  Top 0.406: J2.3 139.23,24.77 138.27,25.73 OK1.3
OPTOANODE
  Top 0.406: R5.1 119.52,31.6 | 119.52,31.6 Q1.3 125,31.6 126,30.6 126,29.73 127,28.73 OK1.2 | 119.52,31.6 119.52,30.02 117.5,28 TP2.1
PRIM1  (via drill 0.45)
  Top 2.54: T1.9 T1.10 T1.11 T1.12
  other vias: 22,38.5 23,38.5 24,38.5 25,38.5 26,38.5 27,38.5 28,38.5 29,38.5 30,38.5 31,38.5 32,38.5 33,38.5 34,38.5 35,38.5 22,37.5 23,37.5 24,37.5 25,37.5 26,37.5 27,37.5 28,37.5 29,37.5 30,37.5 31,37.5 32,37.5 33,37.5 34,37.5 35,37.5 22,39.5 23,39.5 24,39.5 25,39.5 26,39.5 27,39.5 28,39.5 29,39.5 30,39.5 31,39.5 32,39.5 33,39.5 34,39.5 35,39.5 10.5,46.5 10.5,47.5 10.5,48.5 11.5,46.5 11.5,47.5 11.5,48.5 9.5,46.5 9.5,47.5 9.5,48.5 13.5,46.5 13.5,47.5 13.5,48.5 14.5,46.5 14.5,47.5 14.5,48.5 12.5,46.5 12.5,47.5 12.5,48.5 15.5,46.5 15.5,47.5 15.5,48.5 16.5,46.5 16.5,47.5 16.5,48.5 26,49 26,50 26,51 27,49 27,50 27,51 25,49 25,50 25,51 29,49 29,50 29,51 30,49 30,50 30,51 28,49 28,50 28,51 31,49 31,50 31,51 32,49 32,50 32,51
  pour Top (isolate 0.406): -2.5,46 36,46 36,92.5 -2.5,92.5
  pour Top: 36,40 21.5,40 21.5,34.5 36,34.5
  pour Bottom: 36,51.5 8.5,51.5 8.5,34.5 36,34.5
PRIM2  (via drill 0.5)
  Top 0.406: D5.C v17,54
  Top 2.54: T2.3 T2.4 34.5,42 30.5,42 | T2.2 T2.1 22.5,42 26.5,42 | 26.5,42 30.5,42 | T2.3 T2.2 | 26.5,42 T2.2 | 30.5,42 T2.3
  Bottom 0.406: v17,54 5,54 v5,42.5
  pour Top (isolate 0.305, rank 3): -2.5,0.5 36,0.5 36,43 -2.5,43
REF  (via drill 0.35)
  Top 0.406: C4.1 108.2,18.25 Z1.1 116.08,7.62 R1.1 116.08,7.58 v117.5,9 | v121,9 122.1,10.1 IC1.5
  Bottom 0.406: v117.5,9 v121,9
SHIELD
  pour Top: 140,39 115,39 115,36 140,36
SIGGND
  pour Top: 149,34 134.5,34 134.5,-1 149,-1
  pour Bottom: 149,34 134.5,34 134.5,-1 149,-1
VREF  (via drill 0.35)
  Top 0.406: IC1.6 IC1.7 121.47,12.5 v120.5,12.5 | v118.5,13 118.38,13.12 IC1.2
  Bottom 0.406: v120.5,12.5 119,12.5 v118.5,13

### Text on the board
tNames: HV | OUTPUT | V+ | GND | WARNING HV | WARNING, MAY GET TOASTY | BLEEDER | H | O | T | 1V = 1A | R10, R11, Z2, and Q1 / form "basic" FB | C1, C4, C5, C6, IC1, Q1, / R1, R2, R3, R4, R5 / form "complex" FB